# EAGLE schematic alf_board_v8 (EAGLE 6.3)
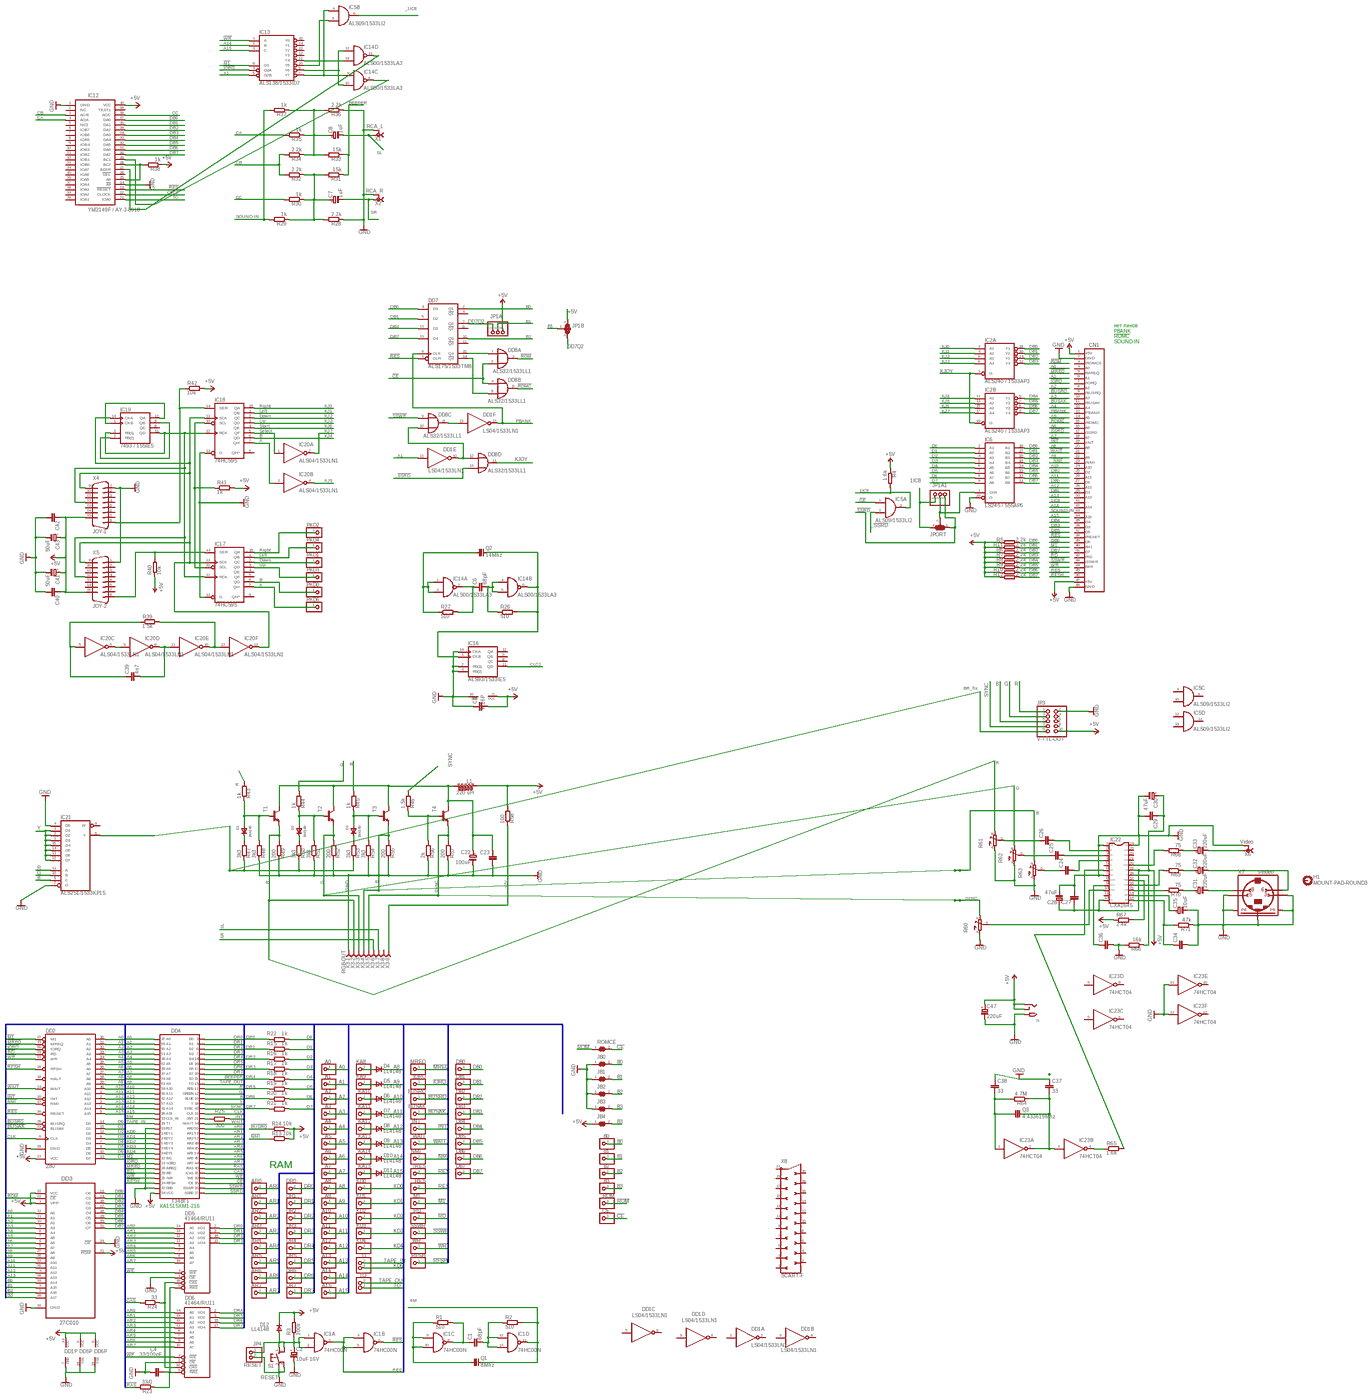
[diagram p0: schematic, sheet 1, overview]
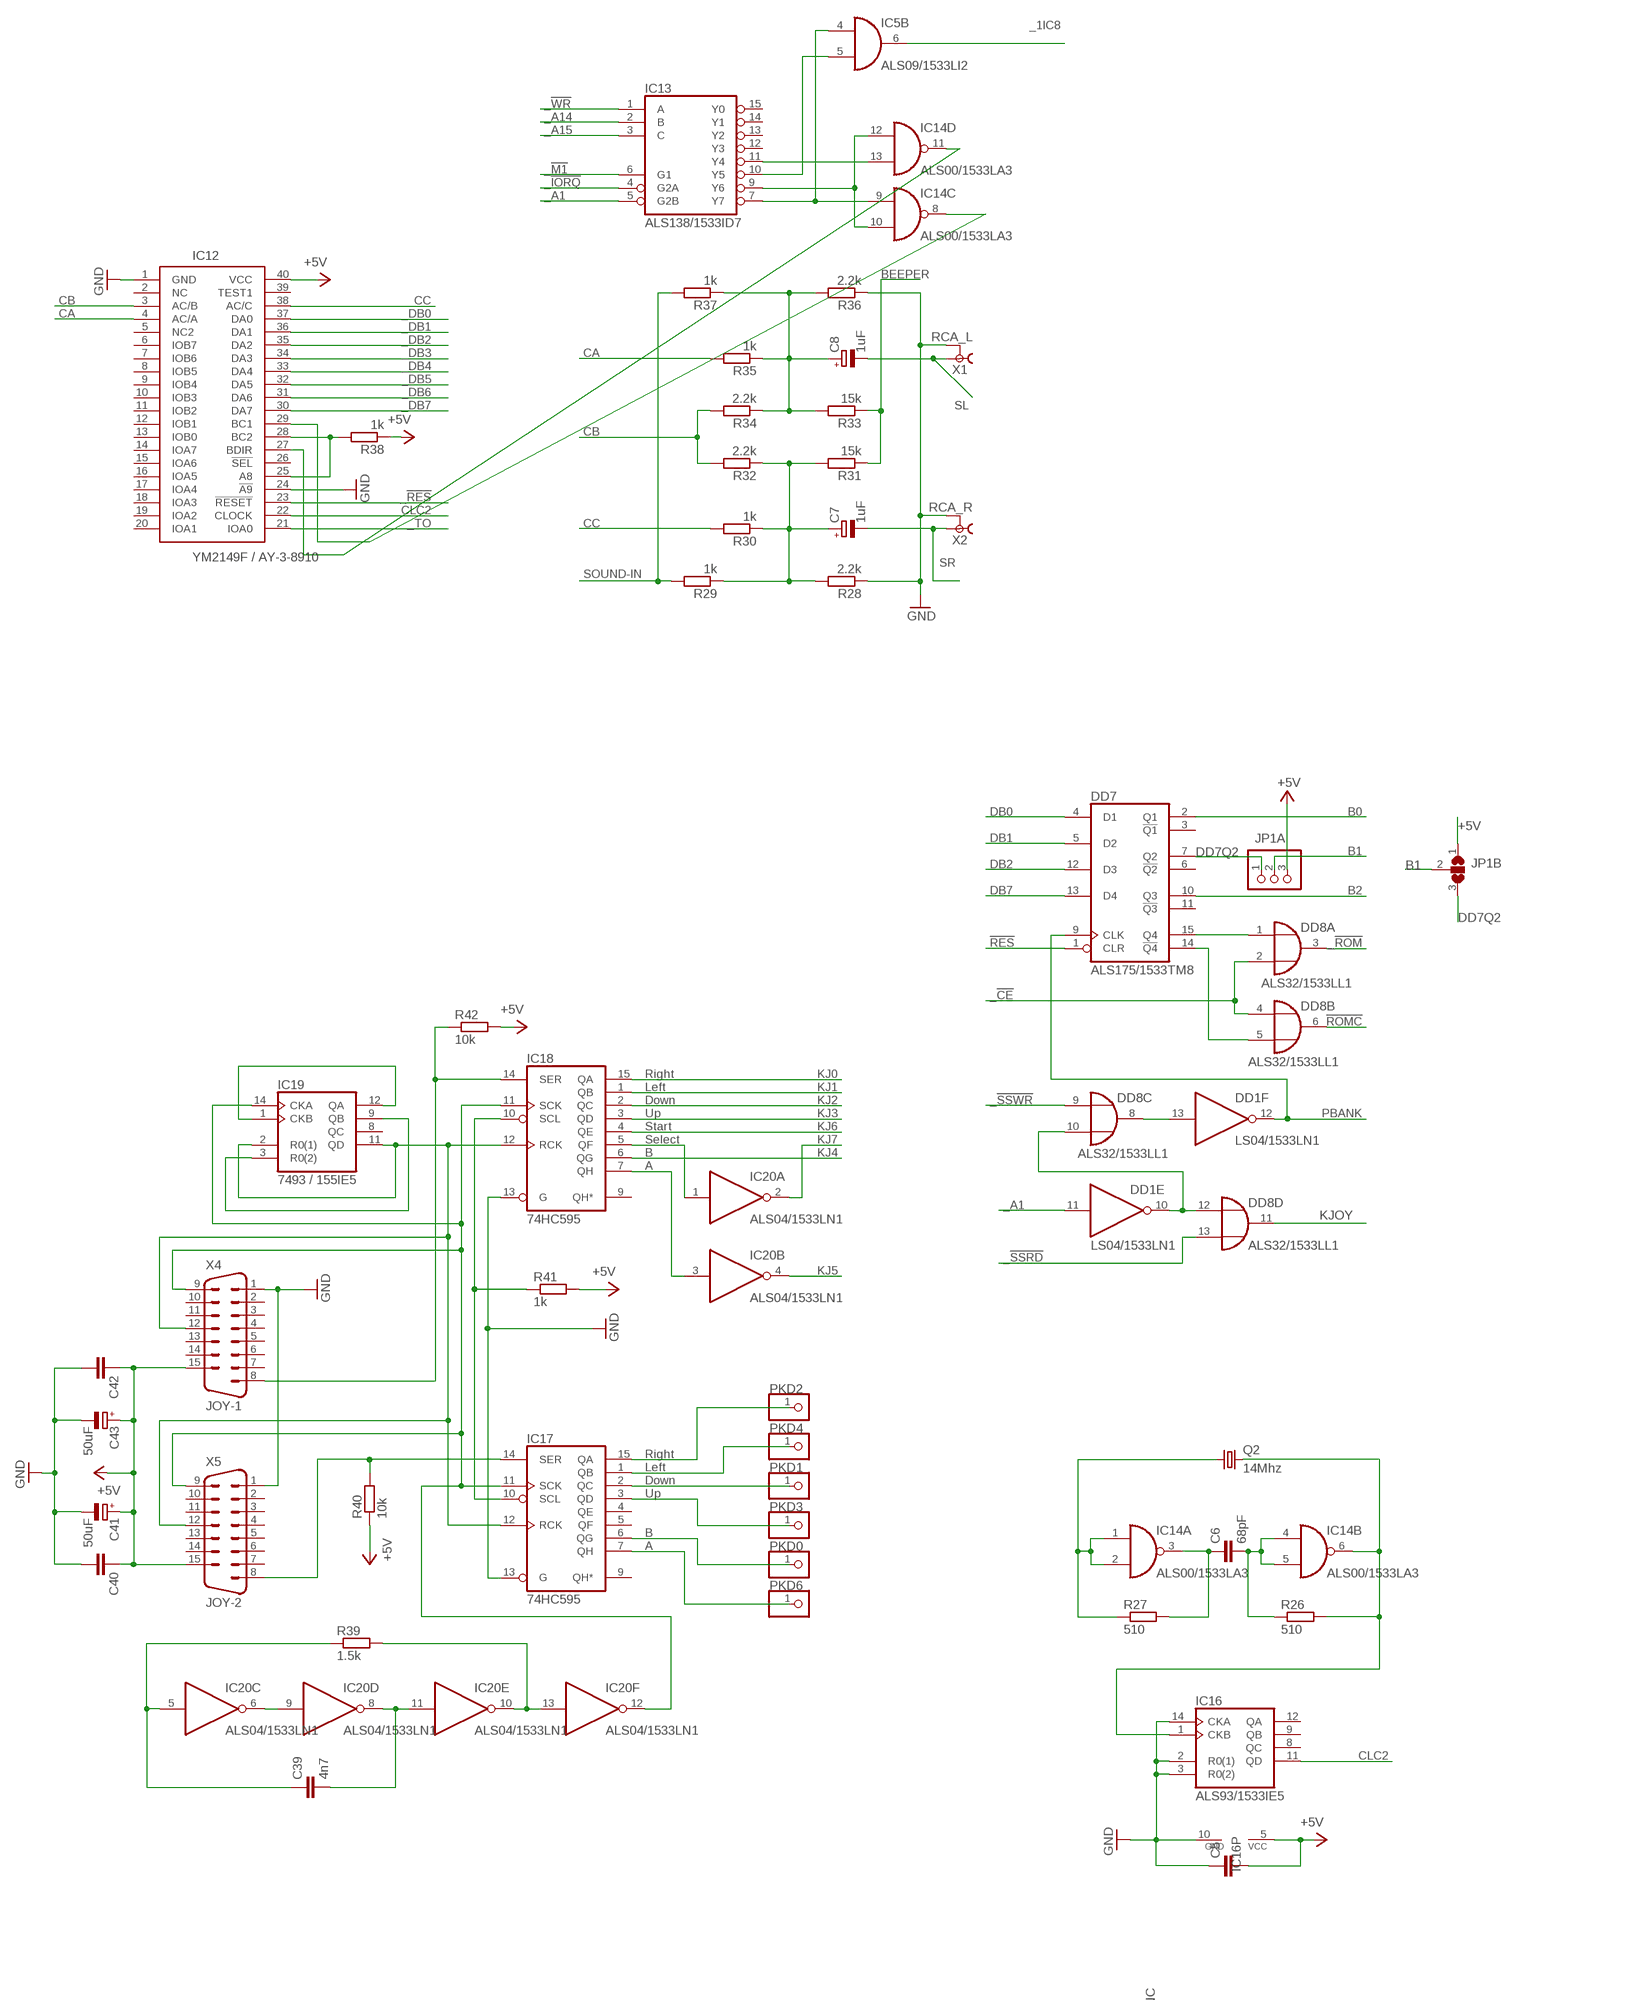
[diagram p1: schematic, sheet 1, part 1 of 4]
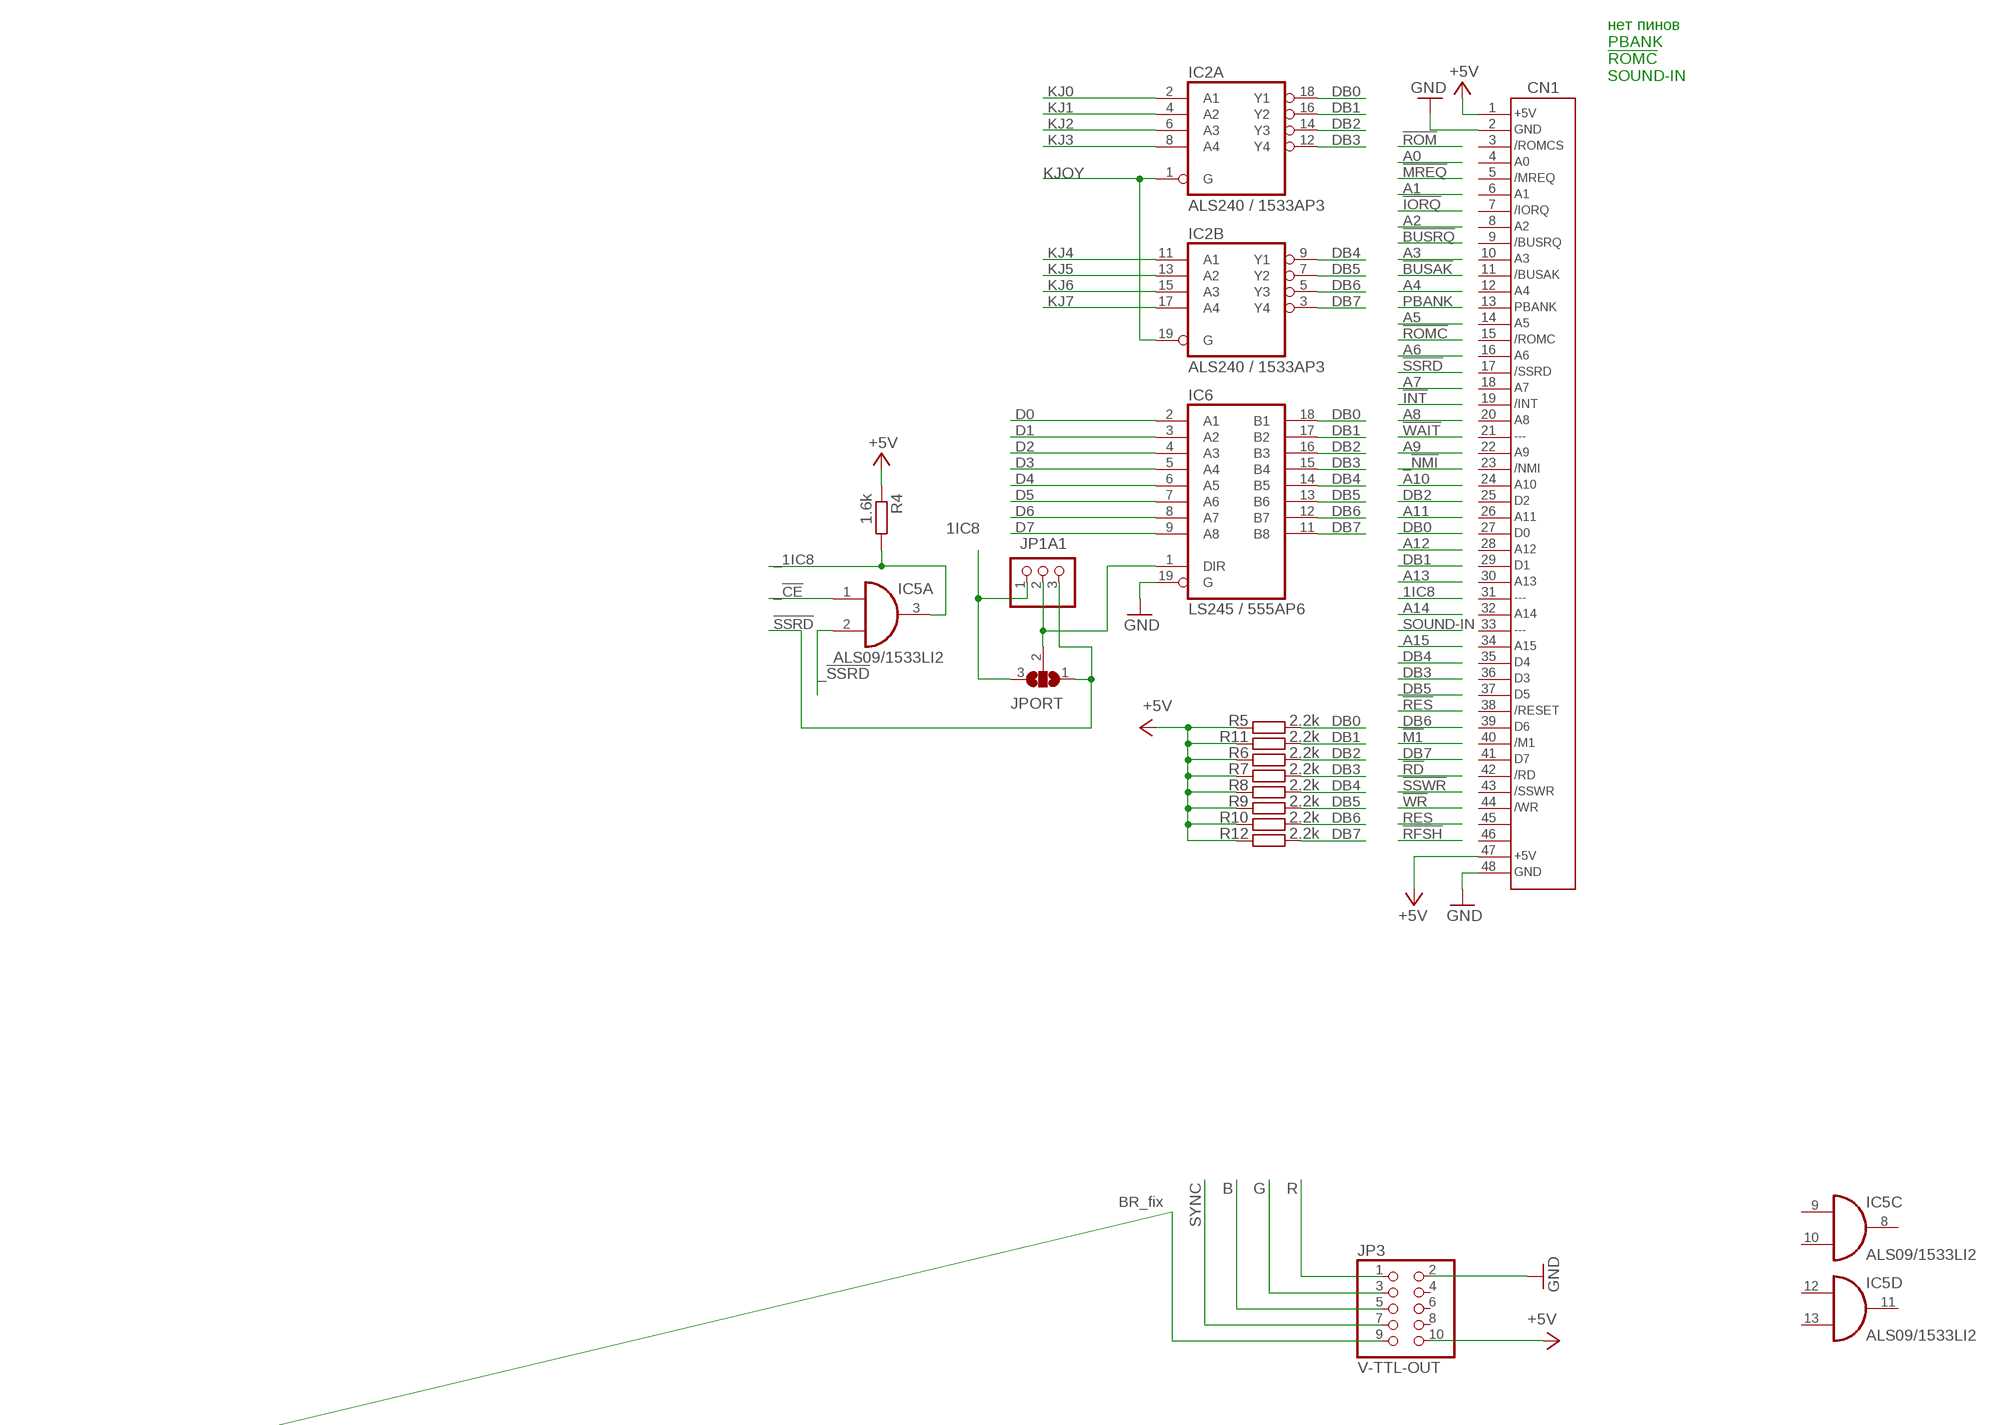
[diagram p2: schematic, sheet 1, part 2 of 4]
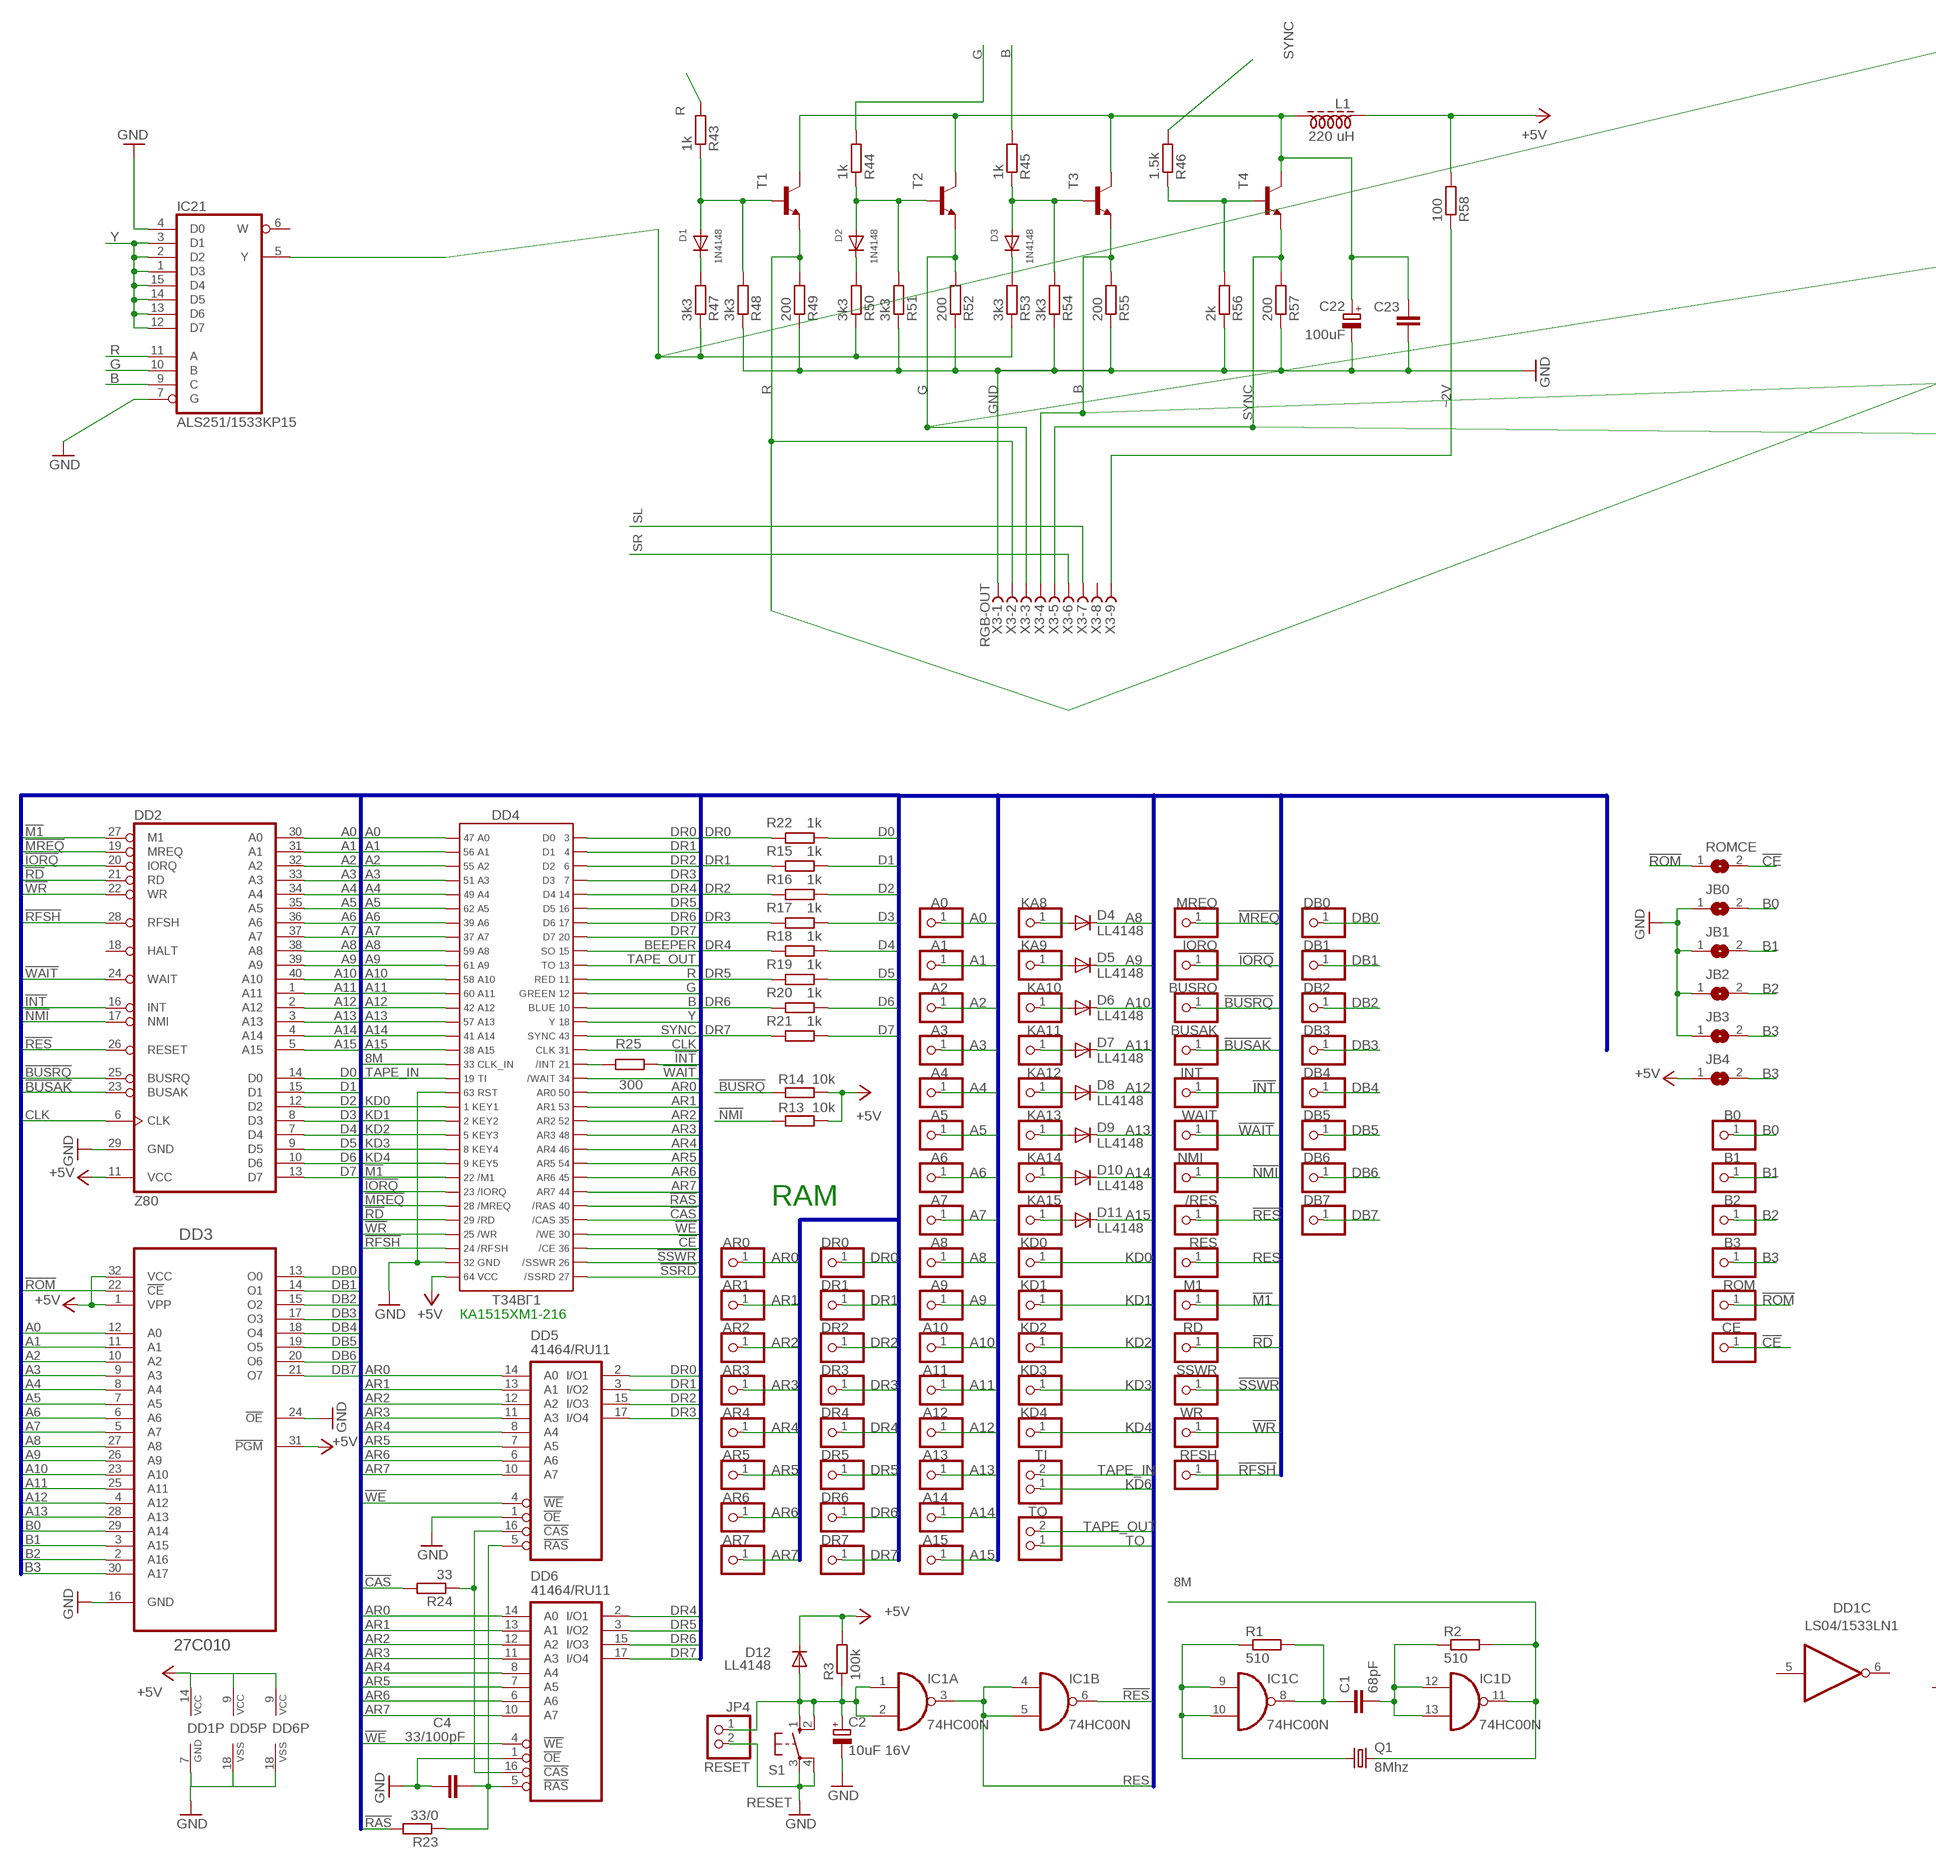
[diagram p3: schematic, sheet 1, part 3 of 4]
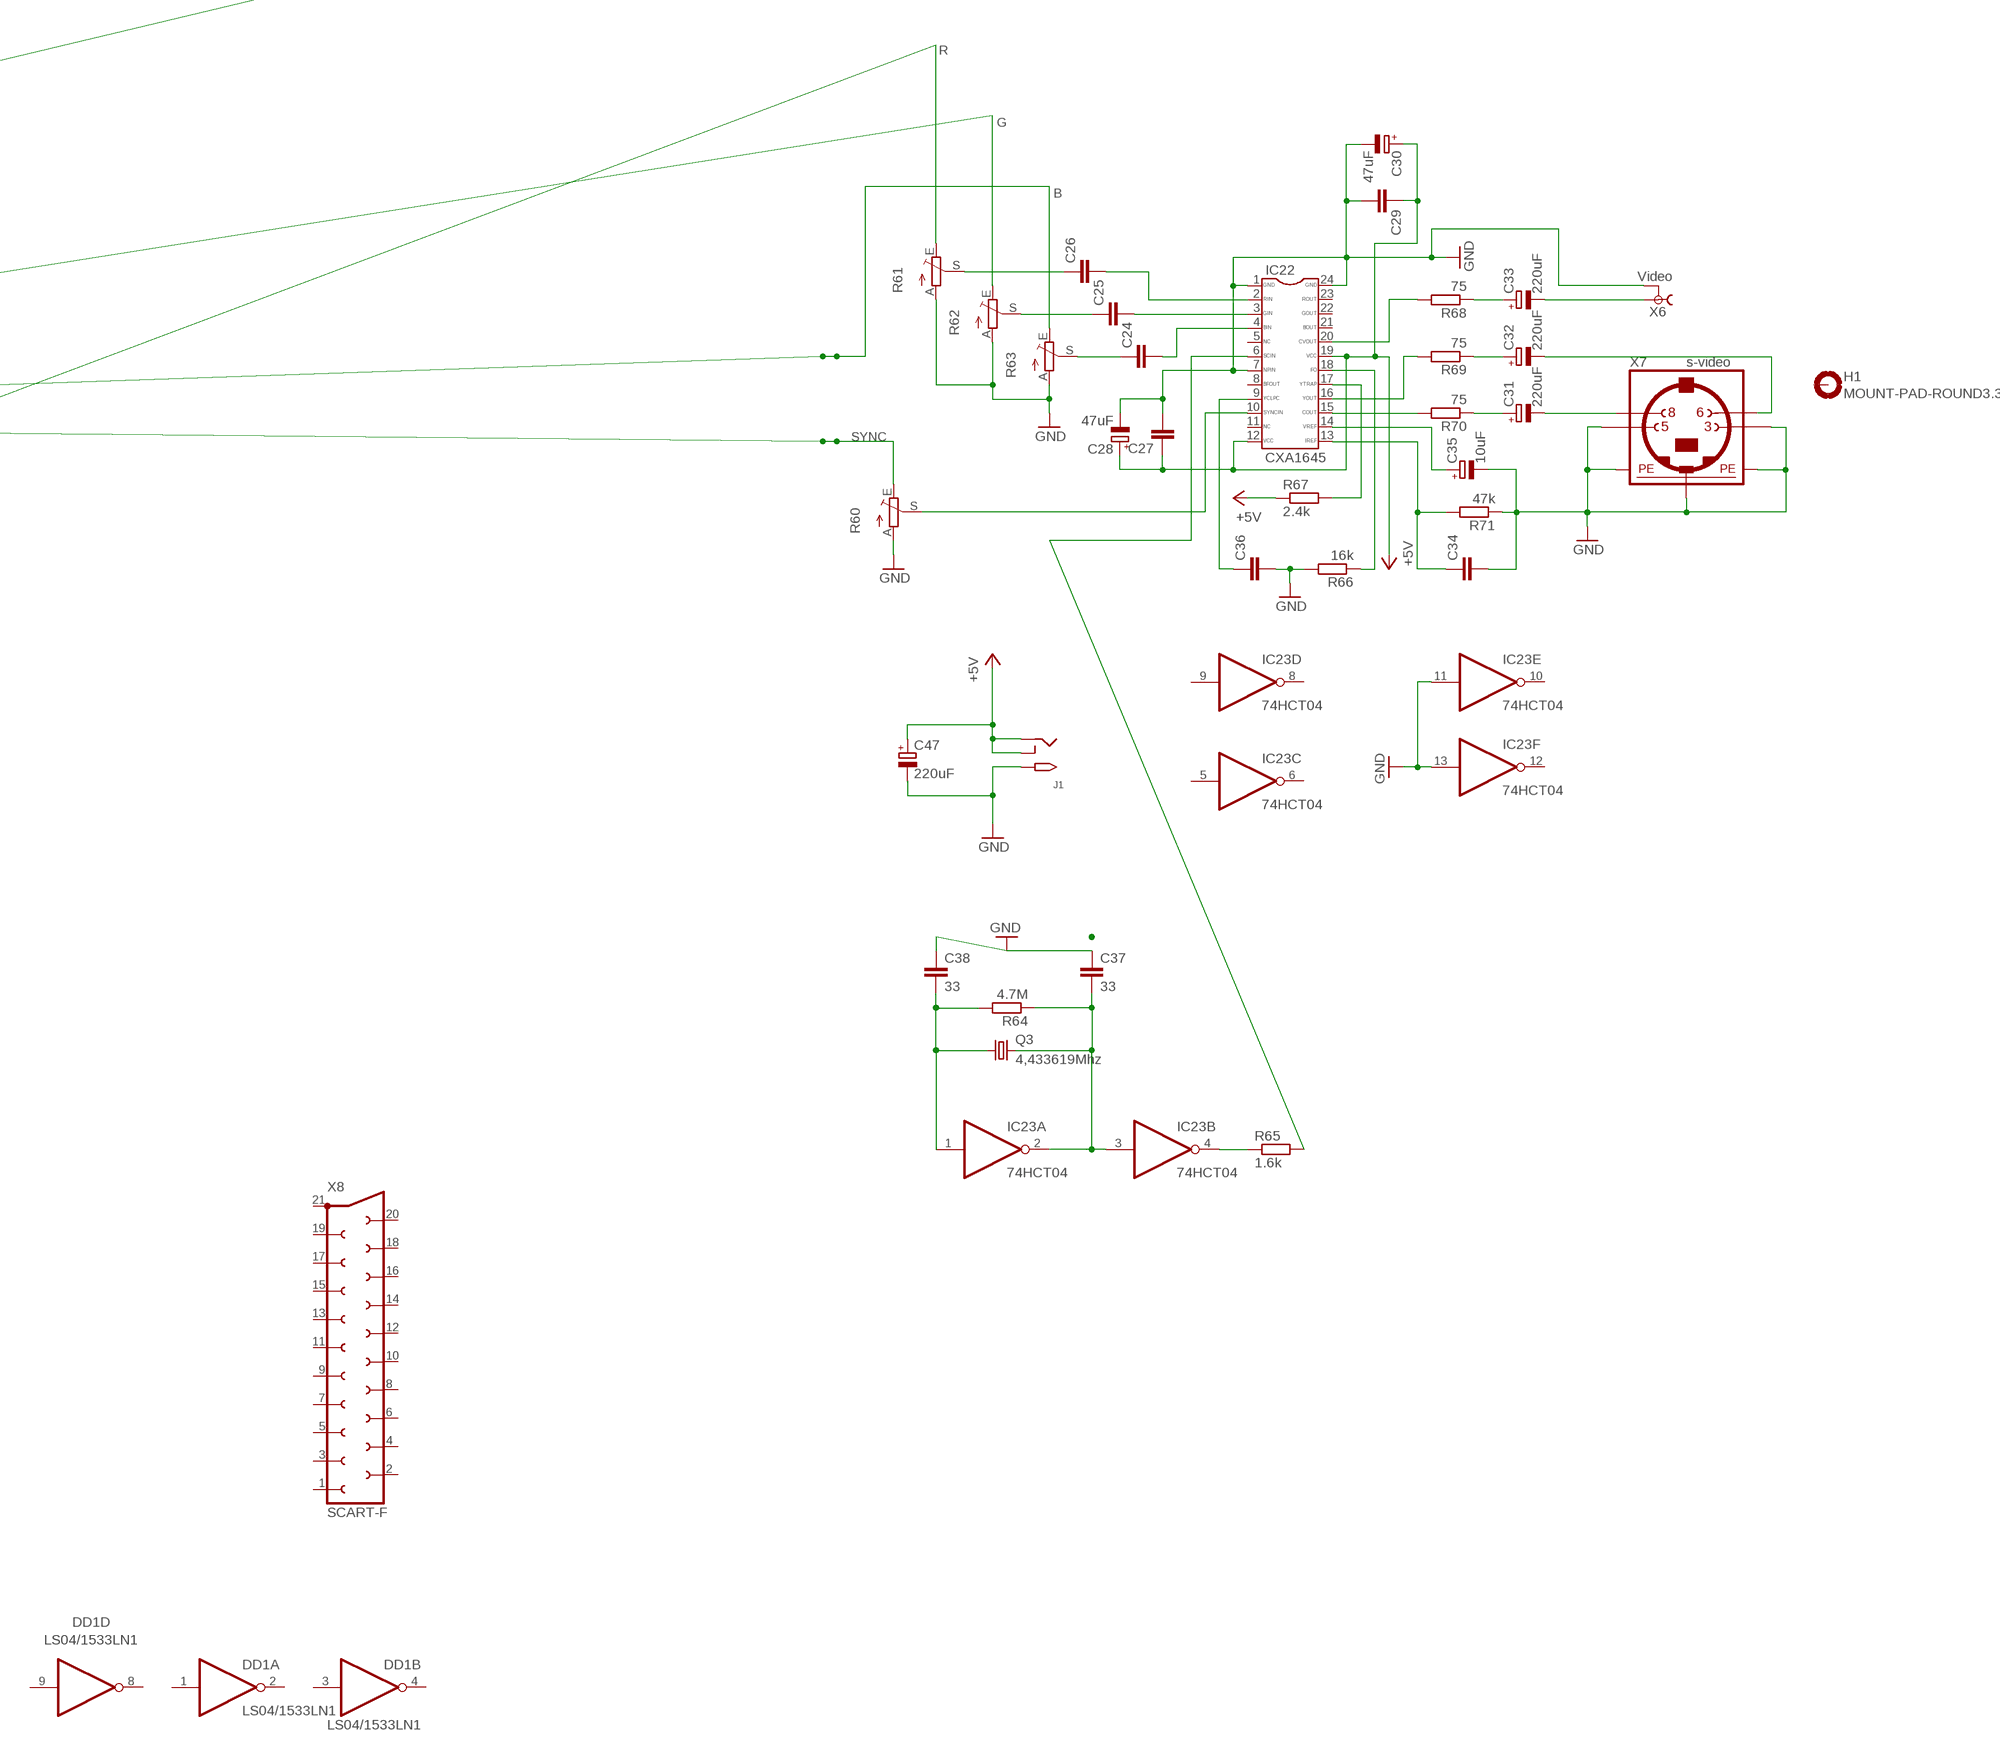
[diagram p4: schematic, sheet 1, part 4 of 4]

## Parts
/RES  PINHD-1X1  [1X01]
A0  PINHD-1X1  [1X01]
A1  PINHD-1X1  [1X01]
A2  PINHD-1X1  [1X01]
A3  PINHD-1X1  [1X01]
A4  PINHD-1X1  [1X01]
A5  PINHD-1X1  [1X01]
A6  PINHD-1X1  [1X01]
A7  PINHD-1X1  [1X01]
A8  PINHD-1X1  [1X01]
A9  PINHD-1X1  [1X01]
A10  PINHD-1X1  [1X01]
A11  PINHD-1X1  [1X01]
A12  PINHD-1X1  [1X01]
A13  PINHD-1X1  [1X01]
A14  PINHD-1X1  [1X01]
A15  PINHD-1X1  [1X01]
AR0  PINHD-1X1  [1X01]
AR1  PINHD-1X1  [1X01]
AR2  PINHD-1X1  [1X01]
AR3  PINHD-1X1  [1X01]
AR4  PINHD-1X1  [1X01]
AR5  PINHD-1X1  [1X01]
AR6  PINHD-1X1  [1X01]
AR7  PINHD-1X1  [1X01]
B0  PINHD-1X1  [1X01]
B1  PINHD-1X1  [1X01]
B2  PINHD-1X1  [1X01]
B3  PINHD-1X1  [1X01]
BUSAK  PINHD-1X1  [1X01]
BUSRQ  PINHD-1X1  [1X01]
C1  68pF  C-EUC0805  [C0805]
C2  10uF 16V  CPOL-EUSMCA  [SMC_A]
C4  33/100pF  C-EU102-043X133  [C102-043X133]
C5  C-EUC0805  [C0805]
C6  68pF  C-EUC0805  [C0805]
C7  1uF  CPOL-EUSMCA  [SMC_A]
C8  1uF  CPOL-EUSMCA  [SMC_A]
C22  100uF  CPOL-EUSMCB  [SMC_B]
C23  C-EUC0805  [C0805]
C24  C-EUC0805  [C0805]
C25  C-EUC0805  [C0805]
C26  C-EUC0805  [C0805]
C27  C-EUC0805  [C0805]
C28  47uF  CPOL-EUSMCB  [SMC_B]
C29  C-EUC0805  [C0805]
C30  47uF  CPOL-EUSMCB  [SMC_B]
C31  220uF  CPOL-EUSMCD  [SMC_D]
C32  220uF  CPOL-EUSMCD  [SMC_D]
C33  220uF  CPOL-EUSMCD  [SMC_D]
C34  C-EUC0805  [C0805]
C35  10uF  CPOL-EUSMCA  [SMC_A]
C36  C-EUC0805  [C0805]
C37  33  C-EUC0805  [C0805]
C38  33  C-EUC0805  [C0805]
C39  4n7  C-EUC0805  [C0805]
C40  C-EUC0805  [C0805]
C41  50uF  CPOL-EUSMCB  [SMC_B]
C42  C-EUC0805  [C0805]
C43  50uF  CPOL-EUSMCB  [SMC_B]
C47  220uF  CPOL-EUSMCD  [SMC_D]
CE  PINHD-1X1  [1X01]
CN1  СНП15-48  [СНП15-48]
D1  1N4148  DIODEDO-1N4148  [DO-1N4148]
D2  1N4148  DIODEDO-1N4148  [DO-1N4148]
D3  1N4148  DIODEDO-1N4148  [DO-1N4148]
D4  LL4148  DIODE-SOD80C  [SOD80C]
D5  LL4148  DIODE-SOD80C  [SOD80C]
D6  LL4148  DIODE-SOD80C  [SOD80C]
D7  LL4148  DIODE-SOD80C  [SOD80C]
D8  LL4148  DIODE-SOD80C  [SOD80C]
D9  LL4148  DIODE-SOD80C  [SOD80C]
D10  LL4148  DIODE-SOD80C  [SOD80C]
D11  LL4148  DIODE-SOD80C  [SOD80C]
D12  LL4148  DIODE-SOD80C  [SOD80C]
DB0  PINHD-1X1  [1X01]
DB1  PINHD-1X1  [1X01]
DB2  PINHD-1X1  [1X01]
DB3  PINHD-1X1  [1X01]
DB4  PINHD-1X1  [1X01]
DB5  PINHD-1X1  [1X01]
DB6  PINHD-1X1  [1X01]
DB7  PINHD-1X1  [1X01]
DD1  LS04/1533LN1  74LS04N  [DIL14]
DD2  Z80  Z80CPU  [DIL40]
DD3  27C010  AT27C020-90PU  [DIP254P1524X482-32P]
DD4  Т34ВГ1  Т34ВГ1MF  [TQFP64-MF]
DD5  41464/RU11  41464  [DIL18]
DD6  41464/RU11  41464  [DIL18]
DD7  ALS175/1533TM8  74LS175N  [DIL16]
DD8  ALS32/1533LL1  74LS32N  [DIL14]
DR0  PINHD-1X1  [1X01]
DR1  PINHD-1X1  [1X01]
DR2  PINHD-1X1  [1X01]
DR3  PINHD-1X1  [1X01]
DR4  PINHD-1X1  [1X01]
DR5  PINHD-1X1  [1X01]
DR6  PINHD-1X1  [1X01]
DR7  PINHD-1X1  [1X01]
H1  MOUNT-PAD-ROUND3.3  [3,3-PAD]
IC1  74HC00N  [DIL14]
IC2  ALS240 / 1533AP3  74LS240N  [DIL20]
IC5  ALS09/1533LI2  74LS09N  [DIL14]
IC6  LS245 / 555AP6  74LS245DW  [SO20W]
IC12  YM2149F / AY-3-8910  YM2149F  [DIL40]
IC13  ALS138/1533ID7  74LS138N  [DIL16]
IC14  ALS00/1533LA3  74LS00N  [DIL14]
IC16  ALS93/1533IE5  74LS93N  [DIL14]
IC17  74HC595  74HC595N  [DIL16]
IC18  74HC595  74HC595N  [DIL16]
IC19  7493 / 155IE5  74LS93N  [DIL14]
IC20  ALS04/1533LN1  74LS04N  [DIL14]
IC21  ALS251/1533KP15  74LS251N  [DIL16]
IC22  CXA1645  [SOP24]
IC23  74HCT04  74HCT04N  [DIL14]
INT  PINHD-1X1  [1X01]
IORQ  PINHD-1X1  [1X01]
J1  2.1MMJACKTHM  [PJ-102A]
JB0  SJ  [SJ]
JB1  SJ  [SJ]
JB2  SJ  [SJ]
JB3  SJ  [SJ]
JB4  SJ  [SJ]
JP1A  PINHD-1X3  [1X03]
JP1A1  PINHD-1X3  [1X03]
JP1B  SJ2W  [SJ_2]
JP3  V-TTL-OUT  PINHD-2X5  [2X05]
JP4  RESET  PINHD-1X2  [1X02]
JPORT  SJ2W  [SJ_2]
KA8  PINHD-1X1  [1X01]
KA9  PINHD-1X1  [1X01]
KA10  PINHD-1X1  [1X01]
KA11  PINHD-1X1  [1X01]
KA12  PINHD-1X1  [1X01]
KA13  PINHD-1X1  [1X01]
KA14  PINHD-1X1  [1X01]
KA15  PINHD-1X1  [1X01]
KD0  PINHD-1X1  [1X01]
KD1  PINHD-1X1  [1X01]
KD2  PINHD-1X1  [1X01]
KD3  PINHD-1X1  [1X01]
KD4  PINHD-1X1  [1X01]
L1  220 uH  Z27/24CW  [Z27/24]
M1  PINHD-1X1  [1X01]
MREQ  PINHD-1X1  [1X01]
NMI  PINHD-1X1  [1X01]
PKD0  PINHD-1X1  [1X01]
PKD1  PINHD-1X1  [1X01]
PKD2  PINHD-1X1  [1X01]
PKD3  PINHD-1X1  [1X01]
PKD4  PINHD-1X1  [1X01]
PKD6  PINHD-1X1  [1X01]
Q1  8Mhz  CRYSTALHC49S  [HC49/S]
Q2  14Mhz  CRYSTALHC49S  [HC49/S]
Q3  4,433619Mhz  CRYSTALHC49S  [HC49/S]
R1  510  R-EU_R0805  [R0805]
R2  510  R-EU_R0805  [R0805]
R3  100k  R-EU_R0805  [R0805]
R4  1.6k  R-EU_R0805  [R0805]
R5  2.2k  R-EU_R0805  [R0805]
R6  2.2k  R-EU_R0805  [R0805]
R7  2.2k  R-EU_R0805  [R0805]
R8  2.2k  R-EU_R0805  [R0805]
R9  2.2k  R-EU_R0805  [R0805]
R10  2.2k  R-EU_R0805  [R0805]
R11  2.2k  R-EU_R0805  [R0805]
R12  2.2k  R-EU_R0805  [R0805]
R13  10k  R-EU_R0805  [R0805]
R14  10k  R-EU_R0805  [R0805]
R15  1k  R-EU_R0805  [R0805]
R16  1k  R-EU_R0805  [R0805]
R17  1k  R-EU_R0805  [R0805]
R18  1k  R-EU_R0805  [R0805]
R19  1k  R-EU_R0805  [R0805]
R20  1k  R-EU_R0805  [R0805]
R21  1k  R-EU_R0805  [R0805]
R22  1k  R-EU_R0805  [R0805]
R23  33/0  R-EU_0207/12  [0207/12]
R24  33  R-EU_0207/10  [0207/10]
R25  300  R-EU_R0805  [R0805]
R26  510  R-EU_R0805  [R0805]
R27  510  R-EU_R0805  [R0805]
R28  2.2k  R-EU_R0805  [R0805]
R29  1k  R-EU_R0805  [R0805]
R30  1k  R-EU_R0805  [R0805]
R31  15k  R-EU_R0805  [R0805]
R32  2.2k  R-EU_R0805  [R0805]
R33  15k  R-EU_R0805  [R0805]
R34  2.2k  R-EU_R0805  [R0805]
R35  1k  R-EU_R0805  [R0805]
R36  2.2k  R-EU_R0805  [R0805]
R37  1k  R-EU_R0805  [R0805]
R38  1k  R-EU_R0805  [R0805]
R39  1.5k  R-EU_R0805  [R0805]
R40  10k  R-EU_R0805  [R0805]
R41  1k  R-EU_R0805  [R0805]
R42  10k  R-EU_R0805  [R0805]
R43  1k  R-EU_R0805  [R0805]
R44  1k  R-EU_R0805  [R0805]
R45  1k  R-EU_R0805  [R0805]
R46  1.5k  R-EU_R0805  [R0805]
R47  3k3  R-EU_R0805  [R0805]
R48  3k3  R-EU_R0805  [R0805]
R49  200  R-EU_R0805  [R0805]
R50  3k3  R-EU_R0805  [R0805]
R51  3k3  R-EU_R0805  [R0805]
R52  200  R-EU_R0805  [R0805]
R53  3k3  R-EU_R0805  [R0805]
R54  3k3  R-EU_R0805  [R0805]
R55  200  R-EU_R0805  [R0805]
R56  2k  R-EU_R0805  [R0805]
R57  200  R-EU_R0805  [R0805]
R58  100  R-EU_R0805  [R0805]
R60  TRIM_EU-CA6V  [CA6V]
R61  TRIM_EU-CA6V  [CA6V]
R62  TRIM_EU-CA6V  [CA6V]
R63  TRIM_EU-CA6V  [CA6V]
R64  4.7M  R-EU_R0805  [R0805]
R65  1.6k  R-EU_R0805  [R0805]
R66  16k  R-EU_R0805  [R0805]
R67  2.4k  R-EU_R0805  [R0805]
R68  75  R-EU_R0805  [R0805]
R69  75  R-EU_R0805  [R0805]
R70  75  R-EU_R0805  [R0805]
R71  47k  R-EU_R0805  [R0805]
RD  PINHD-1X1  [1X01]
RES  PINHD-1X1  [1X01]
RFSH  PINHD-1X1  [1X01]
ROM  PINHD-1X1  [1X01]
ROMCE  SJ  [SJ]
S1  RESET  10-XX  [B3F-10XX]
SSWR  PINHD-1X1  [1X01]
T1  BC549-NPN-TO92-CBE  [TO92-CBE]
T2  BC549-NPN-TO92-CBE  [TO92-CBE]
T3  BC549-NPN-TO92-CBE  [TO92-CBE]
T4  BC549-NPN-TO92-CBE  [TO92-CBE]
TI  PINHD-1X2  [1X02]
TO  PINHD-1X2  [1X02]
WAIT  PINHD-1X1  [1X01]
WR  PINHD-1X1  [1X01]
X1  RCA_L  TOBU3  [TOBU3]
X2  RCA_R  TOBU3  [TOBU3]
X3  RGB-OUT  D-SUB9-H5M09RA  [H5M09RA]
X4  JOY-1  M15HP  [M15HP]
X5  JOY-2  M15HP  [M15HP]
X6  Video  TOBU3  [TOBU3]
X7  s-video  MINI_DIN_4  [M_DIN4]
X8  SCART-F  [SCART-F]

## Nets
1IC8: JP1A1.1 JPORT.3
8M: DD4.33 IC1.11(D:O) Q1.2 R2.2
!BUSAK: BUSAK.1 DD2.23(BUSAK)
!BUSRQ: BUSRQ.1 DD2.25(BUSRQ) R14.2
!CAS: DD4.35 R24.2
!CE: CE.1 DD4.36 ROMCE.2
!INT: DD2.16(INT) INT.1 R25.2
!IORQ: DD2.20(IORQ) DD4.23 IORQ.1
!M1: DD2.27(M1) DD4.22 M1.1
!MREQ: DD2.19(MREQ) DD4.28 MREQ.1
!NMI: DD2.17(NMI) NMI.1 R13.2
!RAS: DD4.40 R23.2
!RD: DD2.21(RD) DD4.29 RD.1
!RES: /RES.1 DD2.26(RESET) DD7.1(CLR) IC1.6(B:O)
!RFSH: DD2.28(RFSH) DD4.24 RFSH.1
!ROM: DD3.22(!CE) ROM.1 ROMCE.1
!ROMC: DD8.6(B:O)
!SSRD: DD4.27 JP1A1.3 JPORT.1
!SSWR: DD4.26 SSWR.1
!WAIT: DD2.24(WAIT) DD4.34 WAIT.1
!WE: DD4.30 DD5.4(!WE) DD6.4(!WE)
!WR: DD2.22(WR) DD4.25 WR.1
+5V: C5.2 C27.1 C28.+ C29.1 C30.+ C40.1 C41.+ C42.1 C43.+ C47.+ CN1.1 CN1.47 D12.C DD1.14(P:VCC) DD2.11(VCC) DD3.1(VPP) DD3.31(!PGM) DD3.32(VCC) DD4.64 DD5.9(VCC) DD6.9(VCC) IC12.40(VCC) IC16.5(VCC) IC22.12 IC22.19 J1.RING J1.RING_SW JB4.1 JP1A.3 JP1B.1 JP3.10 L1.1 R3.2 R4.1 R5.1 R6.1 R7.1 R8.1 R9.1 R10.1 R11.1 R12.1 R13.1 R14.1 R38.1 R40.1 R41.2 R42.2 R58.2 R67.1 X4.15 X5.15
_1IC8: IC5.3(A:O) IC5.6(B:O) R4.2
_!CE: DD8.2(A:I1) DD8.4(B:I0) IC5.1(A:I0)
_!IORQ: IC13.4(G2A)
_!M1: IC13.6(G1)
_!RES: IC12.23(!RESET)
_!ROM: DD8.3(A:O)
_!SSRD: DD8.13(D:I1) IC5.2(A:I1)
_!SSWR: DD8.9(C:I0)
_!WR: IC13.1(A)
_A1: DD1.11(E:I) IC13.5(G2B)
_A14: IC13.2(B)
_A15: IC13.3(C)
_DB0: IC12.37(DA0)
_DB1: IC12.36(DA1)
_DB2: IC12.35(DA2)
_DB3: IC12.34(DA3)
_DB4: IC12.33(DA4)
_DB5: IC12.32(DA5)
_DB6: IC12.31(DA6)
_DB7: IC12.30(DA7)
_TO: IC12.21(IOA0)
A0: A0.1 DD2.30(A0) DD3.12(A0) DD4.47
A1: A1.1 DD2.31(A1) DD3.11(A1) DD4.56
A2: A2.1 DD2.32(A2) DD3.10(A2) DD4.55
A3: A3.1 DD2.33(A3) DD3.9(A3) DD4.51
A4: A4.1 DD2.34(A4) DD3.8(A4) DD4.49
A5: A5.1 DD2.35(A5) DD3.7(A5) DD4.62
A6: A6.1 DD2.36(A6) DD3.6(A6) DD4.39
A7: A7.1 DD2.37(A7) DD3.5(A7) DD4.37
A8: A8.1 D4.C DD2.38(A8) DD3.27(A8) DD4.59
A9: A9.1 D5.C DD2.39(A9) DD3.26(A9) DD4.61
A10: A10.1 D6.C DD2.40(A10) DD3.23(A10) DD4.58
A11: A11.1 D7.C DD2.1(A11) DD3.25(A11) DD4.60
A12: A12.1 D8.C DD2.2(A12) DD3.4(A12) DD4.42
A13: A13.1 D9.C DD2.3(A13) DD3.28(A13) DD4.57
A14: A14.1 D10.C DD2.4(A14) DD4.41
A15: A15.1 D11.C DD2.5(A15) DD4.38
AR0: AR0.1 DD4.50 DD5.14(A0) DD6.14(A0)
AR1: AR1.1 DD4.53 DD5.13(A1) DD6.13(A1)
AR2: AR2.1 DD4.52 DD5.12(A2) DD6.12(A2)
AR3: AR3.1 DD4.48 DD5.11(A3) DD6.11(A3)
AR4: AR4.1 DD4.46 DD5.8(A4) DD6.8(A4)
AR5: AR5.1 DD4.54 DD5.7(A5) DD6.7(A5)
AR6: AR6.1 DD4.45 DD5.6(A6) DD6.6(A6)
AR7: AR7.1 DD4.44 DD5.10(A7) DD6.10(A7)
B: DD4.10 IC21.9(C) JP3.5 R45.2
B0: B0.1 DD3.29(A14) DD7.2(Q1) JB0.2
B1: B1.1 DD3.3(A15) JB1.2 JP1A.2 JP1B.2
B2: B2.1 DD3.2(A16) DD7.10(Q3) JB2.2
B3: B3.1 DD3.30(A17) JB3.2 JB4.2
BEEPER: DD4.15 R31.1 R33.1
CA: IC12.4(AC/A) R35.2
CAS_RAM: DD5.16(!CAS) DD6.16(!CAS) R24.1
CB: IC12.3(AC/B) R32.2 R34.2
CC: IC12.38(AC/C) R30.2
CLC2: IC12.22(CLOCK) IC16.11(QD)
CLK: DD2.6(CLK) DD4.31
D0: DD2.14(D0) IC6.2(A1) R22.1
D1: DD2.15(D1) IC6.3(A2) R15.1
D2: DD2.12(D2) IC6.4(A3) R16.1
D3: DD2.8(D3) IC6.5(A4) R17.1
D4: DD2.7(D4) IC6.6(A5) R18.1
D5: DD2.9(D5) IC6.7(A6) R19.1
D6: DD2.10(D6) IC6.8(A7) R20.1
D7: DD2.13(D7) IC6.9(A8) R21.1
DB0: DB0.1 DD3.13(O0) DD7.4(D1) IC2.18(A:Y1) IC6.18(B1) R5.2
DB1: DB1.1 DD3.14(O1) DD7.5(D2) IC2.16(A:Y2) IC6.17(B2) R11.2
DB2: DB2.1 DD3.15(O2) DD7.12(D3) IC2.14(A:Y3) IC6.16(B3) R6.2
DB3: DB3.1 DD3.17(O3) IC2.12(A:Y4) IC6.15(B4) R7.2
DB4: DB4.1 DD3.18(O4) IC2.9(B:Y1) IC6.14(B5) R8.2
DB5: DB5.1 DD3.19(O5) IC2.7(B:Y2) IC6.13(B6) R9.2
DB6: DB6.1 DD3.20(O6) IC2.5(B:Y3) IC6.12(B7) R10.2
DB7: DB7.1 DD3.21(O7) DD7.13(D4) IC2.3(B:Y4) IC6.11(B8) R12.2
DD7Q2: DD7.7(Q2) JP1A.1 JP1B.3
DR0: DD4.3 DD5.2(I/O1) DR0.1 R22.2
DR1: DD4.4 DD5.3(I/O2) DR1.1 R15.2
DR2: DD4.6 DD5.15(I/O3) DR2.1 R16.2
DR3: DD4.7 DD5.17(I/O4) DR3.1 R17.2
DR4: DD4.14 DD6.2(I/O1) DR4.1 R18.2
DR5: DD4.16 DD6.3(I/O2) DR5.1 R19.2
DR6: DD4.17 DD6.15(I/O3) DR6.1 R20.2
DR7: DD4.20 DD6.17(I/O4) DR7.1 R21.2
G: DD4.12 IC21.10(B) JP3.3 R44.2
GND: C2.- C4.1 C5.1 C22.- C23.2 C27.2 C28.- C29.2 C30.- C34.2 C35.- C36.2 C37.1 C38.1 C40.2 C41.- C42.2 C43.- C47.- CN1.2 CN1.48 DD1.7(P:GND) DD2.29(GND) DD3.16(GND) DD3.24(!OE) DD4.32 DD4.63 DD5.1(!OE) DD5.18(VSS) DD6.1(!OE) DD6.18(VSS) IC6.19(G) IC12.1(GND) IC12.24(!A9) IC16.2(R0(1)) IC16.3(R0(2)) IC16.10(GND) IC16.14(CKA) IC17.13(G) IC18.13(G) IC21.4(D0) IC21.7(G) IC22.1 IC22.7 IC22.24 IC23.11(E:I) IC23.13(F:I) J1.TIP JB0.1 JB1.1 JB2.1 JB3.1 JP3.2 JP4.2 R28.1 R36.1 R48.1 R49.1 R51.1 R52.1 R54.1 R55.1 R56.1 R57.1 R60.A R61.A R62.A R63.A R66.2 R71.1 S1.3(P) S1.4(P1) X1.2 X1.2@1 X1.2@2 X2.2 X2.2@1 X2.2@2 X3.1 X4.1 X5.1 X6.2 X6.2@1 X6.2@2 X7.3 X7.5 X7.SH1(PE1) X7.SH2(PE2) X7.SH3(PE3)
KD0: DD4.1 KD0.1
KD1: DD4.2 KD1.1
KD2: DD4.5 KD2.1
KD3: DD4.8 KD3.1
KD4: DD4.9 KD4.1
KD6: TI.1
KJ0: IC2.2(A:A1) IC18.15(QA)
KJ1: IC2.4(A:A2) IC18.1(QB)
KJ2: IC2.6(A:A3) IC18.2(QC)
KJ3: IC2.8(A:A4) IC18.3(QD)
KJ4: IC2.11(B:A1) IC18.6(QG)
KJ5: IC2.13(B:A2) IC20.4(B:O)
KJ6: IC2.15(B:A3) IC18.4(QE)
KJ7: IC2.17(B:A4) IC20.2(A:O)
KJOY: DD8.11(D:O) IC2.1(A:G) IC2.19(B:G)
N$1: IC23.4(B:O) R65.1
N$2: C1.1 IC1.8(C:O) R1.2
N$3: C1.2 IC1.12(D:I0) IC1.13(D:I1) R2.1
N$4: IC1.9(C:I0) IC1.10(C:I1) Q1.1 R1.1
N$5: IC18.5(QF) IC20.1(A:I)
N$6: IC18.7(QH) IC20.3(B:I)
N$7: DD1.13(F:I) DD8.8(C:O)
N$8: C2.+ D12.A IC1.1(A:I0) IC1.2(A:I1) JP4.1 R3.1 S1.1(S) S1.2(S1)
N$9: D4.A KA8.1
N$10: DD1.10(E:O) DD8.10(C:I1) DD8.12(D:I0)
N$11: DD7.14(!Q4) DD8.5(B:I1)
N$13: DD7.15(Q4) DD8.1(A:I0)
N$14: IC17.12(RCK) IC18.12(RCK) IC19.2(R0(1)) IC19.11(QD) X4.12 X5.12
N$15: IC17.7(QH) PKD6.1
N$16: IC12.25(A8) IC12.28(BC2) R38.2
N$17: D1.A R43.1 R48.2 T1.B
N$18: D1.C R47.2
N$19: R49.2 R61.E T1.E X3.2
N$21: D2.A R44.1 R51.2 T2.B
N$22: D2.C R50.2
N$23: R52.2 R62.E T2.E X3.3
N$24: IC22.17 R67.2
N$25: IC12.27(BDIR) IC14.11(D:O)
N$26: IC5.4(B:I0) IC13.7(Y7) IC14.9(C:I0)
N$27: IC13.11(Y4) IC14.13(D:I1)
N$28: IC5.5(B:I1) IC13.10(Y5)
N$29: IC13.9(Y6) IC14.10(C:I1) IC14.12(D:I0)
N$30: IC17.10(SCL) IC18.10(SCL) R41.1
N$31: IC12.29(BC1) IC14.8(C:O)
N$32: C8.+ R33.2 R34.1 R35.1 R36.2 R37.1
N$33: C7.+ R28.2 R29.1 R30.1 R31.2 R32.1
N$34: D3.A R45.1 R54.2 T3.B
N$35: IC17.11(SCK) IC18.11(SCK) IC19.14(CKA) IC20.12(F:O) X4.9 X5.9
N$36: C39.1 IC20.5(C:I) R39.1
N$37: IC14.6(B:O) IC16.1(CKB) Q2.2 R26.2
N$38: IC14.1(A:I0) IC14.2(A:I1) Q2.1 R27.1
N$39: C6.1 IC14.3(A:O) R27.2
N$40: C6.2 IC14.4(B:I0) IC14.5(B:I1) R26.1
N$41: D3.C R53.2
N$42: R55.2 R63.E T3.E X3.4
N$43: R57.2 R60.E T4.E X3.5
N$44: C22.+ C23.1 L1.2 T1.C T2.C T3.C T4.C
N$45: R58.1 X3.9
N$46: IC17.14(SER) R40.2 X5.8
N$47: IC19.3(R0(2)) IC19.9(QB)
N$48: IC18.14(SER) R42.1 X4.8
N$49: IC19.1(CKB) IC19.12(QA)
N$50: C39.2 IC20.8(D:O) IC20.11(E:I)
N$51: IC20.10(E:O) IC20.13(F:I) R39.2
N$52: C26.1 R61.S
N$53: IC20.6(C:O) IC20.9(D:I)
N$54: C25.1 R62.S
N$55: C24.1 R63.S
N$56: C25.2 IC22.3
N$57: C26.2 IC22.2
N$58: C24.2 IC22.4
N$59: C38.2 IC23.1(A:I) Q3.1 R64.2
N$60: C37.2 IC23.2(A:O) IC23.3(B:I) Q3.2 R64.1
N$61: IC22.10 R60.S
N$62: IC21.5(Y) JP3.9 R47.1 R50.1 R53.1
N$63: IC22.6 R65.2
N$64: IC22.20 R68.2
N$65: C36.1 IC22.9
N$66: IC22.18 R66.1
N$67: IC22.16 R69.2
N$68: IC22.15 R70.2
N$69: C33.+ R68.1
N$70: C32.+ R69.1
N$71: C31.+ R70.1
N$72: C35.+ IC22.14
N$73: C34.1 IC22.13 R71.2
N$75: C33.- X6.1
N$78: C32.- X7.6
N$79: C31.- X7.8
N$92: IC17.6(QG) PKD0.1
N$93: D5.A KA9.1
N$94: D6.A KA10.1
N$95: D7.A KA11.1
N$96: D8.A KA12.1
N$97: D9.A KA13.1
N$98: D10.A KA14.1
N$99: D11.A KA15.1
N$100: IC6.1(DIR) JP1A1.2 JPORT.2
N$126: R46.1 R56.2 T4.B
N$127: IC17.3(QD) PKD3.1
N$128: IC17.2(QC) PKD1.1
N$129: IC17.15(QA) PKD2.1
N$130: IC17.1(QB) PKD4.1
PBANK: DD1.12(F:O) DD7.9(CLK)
R: DD4.11 IC21.11(A) JP3.1 R43.2
R_INT: DD4.21 R25.1
RAS_RAM: C4.2 DD5.5(!RAS) DD6.5(!RAS) R23.1
RES: IC1.3(A:O) IC1.4(B:I0) IC1.5(B:I1) RES.1
SL: C8.- X1.1 X3.7
SOUND-IN: R29.2 R37.2
SR: C7.- X2.1 X3.6
SYNC: DD4.43 JP3.7 R46.2
TAPE_IN: DD4.19 TI.2
TAPE_OUT: DD4.13 TO.2
TO: TO.1
Y: DD4.18 IC21.1(D3) IC21.2(D2) IC21.3(D1) IC21.12(D7) IC21.13(D6) IC21.14(D5) IC21.15(D4)
Unconnected: CN1.3 CN1.4 CN1.5 CN1.6 CN1.7 CN1.8 CN1.9 CN1.10 CN1.11 CN1.12 CN1.13 CN1.14 CN1.15 CN1.16 CN1.17 CN1.18 CN1.19 CN1.20 CN1.21 CN1.22 CN1.23 CN1.24 CN1.25 CN1.26 CN1.27 CN1.28 CN1.29 CN1.30 CN1.31 CN1.32 CN1.33 CN1.34 CN1.35 CN1.36 CN1.37 CN1.38 CN1.39 CN1.40 CN1.41 CN1.42 CN1.43 CN1.44 CN1.45 CN1.46 DD1.1(A:I) DD1.2(A:O) DD1.3(B:I) DD1.4(B:O) DD1.5(C:I) DD1.6(C:O) DD1.8(D:O) DD1.9(D:I) DD2.18(HALT) DD7.3(!Q1) DD7.6(!Q2) DD7.11(!Q3) H1.B3,3(MOUNT) IC5.8(C:O) IC5.9(C:I0) IC5.10(C:I1) IC5.11(D:O) IC5.12(D:I0) IC5.13(D:I1) IC12.2(NC) IC12.5(NC2) IC12.6(IOB7) IC12.7(IOB6) IC12.8(IOB5) IC12.9(IOB4) IC12.10(IOB3) IC12.11(IOB2) IC12.12(IOB1) IC12.13(IOB0) IC12.14(IOA7) IC12.15(IOA6) IC12.16(IOA5) IC12.17(IOA4) IC12.18(IOA3) IC12.19(IOA2) IC12.20(IOA1) IC12.26(!SEL) IC12.39(TEST1) IC13.12(Y3) IC13.13(Y2) IC13.14(Y1) IC13.15(Y0) IC16.8(QC) IC16.9(QB) IC16.12(QA) IC17.4(QE) IC17.5(QF) IC17.9(QH*) IC18.9(QH*) IC19.8(QC) IC21.6(W) IC22.5 IC22.8 IC22.11 IC22.21 IC22.22 IC22.23 IC23.5(C:I) IC23.6(C:O) IC23.8(D:O) IC23.9(D:I) IC23.10(E:O) IC23.12(F:O) JP3.4 JP3.6 JP3.8 X3.8 X4.2 X4.3 X4.4 X4.5 X4.6 X4.7 X4.10 X4.11 X4.13 X4.14 X5.2 X5.3 X5.4 X5.5 X5.6 X5.7 X5.10 X5.11 X5.13 X5.14 X8.1 X8.2 X8.3 X8.4 X8.5 X8.6 X8.7 X8.8 X8.9 X8.10 X8.11 X8.12 X8.13 X8.14 X8.15 X8.16 X8.17 X8.18 X8.19 X8.20 X8.21

## Buses
A[0..15],AR[0..7],D[0..7],DB[0..7],DR[0..7],KD[0..6],KJ[0..7],B[0..3],!ROM,!MREQ,!IORQ,!BUSRQ,!BUSAK,PBANK,!ROMC,!SSRD,!INT,!NMI,!RES,RES,!M1,!SSRD,!RD,!SSWR,!WR,!RFSH,!RAS,!CAS,!WE,!WAIT,!CE,8M,CLK,CLC2,SYNC,BR,R,G,B,CA,CB,CC,BEEPER,SR,SL,1IC8,SOUND-IN,TO,TAPE_IN,TAPE_OUT

## Notes on the sheet
- нет пинов
  PBANK
  !ROMC
  SOUND-IN
- Right
- Left
- Down
- Up
- Start
- Select
- B
- A
- Right
- Left
- Down
- Up
- B
- A
- BR_fix
- R
- G
- B
- R | G | GND | B | SYNC | ~2V
- SYNC
- RAM
- КА1515ХМ1-216

## Power pins joined to a net without a drawn wire
GND: DD7.8(GND) DD8.7(P:GND) IC1.7(P:GND) IC2.10(P:GND) IC5.7(P:GND) IC6.10(GND) IC13.8(GND) IC14.7(P:GND) IC17.8(GND) IC18.8(GND) IC19.10(GND) IC20.7(P:GND) IC21.8(GND) IC23.7(P:GND)
VCC: DD7.16(VCC) DD8.14(P:VCC) IC1.14(P:VCC) IC2.20(P:VCC) IC5.14(P:VCC) IC6.20(VCC) IC13.16(VCC) IC14.14(P:VCC) IC17.16(VCC) IC18.16(VCC) IC19.5(VCC) IC20.14(P:VCC) IC21.16(VCC) IC23.14(P:VCC)

## Library data of the parts
/RES A0 A1-A15 AR0 AR1-AR7 B0 B1-B3 BUSAK BUSRQ CE DB0 DB1-DB7 DR0 DR1-DR7 INT IORQ KA8-KA15 KD0 KD1-KD4 M1 MREQ NMI PKD0 PKD1-PKD4 PKD6 RD RES RFSH ROM SSWR WAIT WR = pinhead:PINHD-1X1: PIN HEADER
C1 C4-C6 C23-C27 C29 C34 C36-C40 C42 = rcl:C-EU: CAPACITOR, European symbol; OC_FARNELL: unknown
C2 = rcl:CPOL-EU: POLARIZED CAPACITOR, European symbol; MF: MULTICOMP; MPN: MCNP35V106M5X11; OC_FARNELL: 1236669
C7 C8 C22 C28 C30-C33 C35 C41 C43 C47 = rcl:CPOL-EU: POLARIZED CAPACITOR, European symbol; OC_FARNELL: unknown
CN1 = alf_cartridge_slot:СНП15-48; OC_FARNELL: unknown
D1-D3 = adafruit:DIODE: Diode SMADIODE - SMA Surface Mount Package 20V 1A Schottky Diode Digikey: 641-1014-6-ND DO-1N4148 - Through Hole Small Current Diode SOD-123 20V 1 A (.5mV Vf) Schottky Diode - Digikey: MBRX120TPMSCT-ND SOD-323 10V 570mA (.38mV Vf, 3ns) Schottky Diode - Digikey: ZLLS410CT-ND SOD-523 30V 30mA Schottky Diode (RB751S-40TE61) - Digikey: RB751S-40TE61CT-ND SOT23-R/W - SOT23 Package (R = Solder Paste/Reflow Ovens, W = Hand-Soldering) BAT54Film 40V 300mA - Digikey: 497-7162-1-ND; OC_FARNELL: unknown
D4-D12 = diode:DIODE-: DIODE
DD1 IC20 = 74xx-eu:74*04: Hex INVERTER; OC_FARNELL: unknown
DD2 = zilog:Z80CPU: Z80 FAMILY DEVICE
DD3 = AT27C020:AT27C020-90PU: ONE TIME PROGRAMMABLE (OTP) EPROM IC,2Mb (256K x 8),PDIP-32; MF: ATMEL; MPN: AT27C020-90PU; OC_FARNELL: 1095777; OC_NEWARK: 68T4266; PACKAGE: PDIP-32; SUPPLIER: ATMEL
DD4 = Т43ВГ1:Т34ВГ1
DD5 DD6 = memories:41464: DRAM 64K x 4 bits
DD7 = 74xx-eu:74*175: Qadruple D type FLIP FLOP, clear; OC_FARNELL: unknown
DD8 = 74xx-eu:74*32: Quad 2-input OR gate; OC_FARNELL: unknown
H1 = holes:MOUNT-PAD-ROUND: MOUNTING PAD, round
IC1 = 74xx-eu:74*00: Quad 2-input NAND gate
IC2 = 74xx-eu:74*240: Octal BUFFER and LINE DRIVER, 3-state; OC_FARNELL: unknown
IC5 = 74xx-eu:74*09: Quad 2-input AND gate, open collector; OC_FARNELL: unknown
IC6 = 74xx-eu:74*245: Octal BUS TRANSCEIVER, 3-state; OC_FARNELL: unknown
IC12 = ym2149f:YM2149F; OC_FARNELL: unknown
IC13 = 74xx-eu:74*138: 3-line to 8-line DECODER/DEMULTIPLEXER; OC_FARNELL: unknown
IC14 = 74xx-eu:74*00: Quad 2-input NAND gate; OC_FARNELL: unknown
IC16 IC19 = 74xx-eu:74*93: Decade, divide by twelve and binary COUNTER; OC_FARNELL: unknown
IC17 IC18 = 74xx-eu:74*595: 8-bit SHIFT REGISTER, output latch; OC_FARNELL: unknown
IC21 = 74xx-eu:74*251: 1 of 8 data SELECTOR/MULTIPLEXER, 3-state; OC_FARNELL: unknown
IC22 = CXA1645M:CXA1645; OC_FARNELL: unknown
IC23 = 74xx-eu:74*04: Hex INVERTER
J1 = adafruit:2.1MMJACK: 2.1mm x 5.5mm THM DC jack with internal switch. Digikey part #PJ-102A, 4UCON part #05537 2.1mm x 5.5mm SMT DC jack with internal switch. Digikey part #PJ-002A-SMT, 4UCON part #03267 By microbuilder.eu & adafruit.com
JB0 JB1-JB4 ROMCE = jumper:SJ: SMD solder JUMPER
JP1A JP1A1 = pinhead:PINHD-1X3: PIN HEADER; OC_FARNELL: unknown
JP1B JPORT = jumper:SJ2W: SMD solder JUMPER
JP3 = pinhead:PINHD-2X5: PIN HEADER; OC_FARNELL: unknown
JP4 TI TO = pinhead:PINHD-1X2: PIN HEADER
L1 = inductor-neosid:Z?CW: CHOKE free-suspension choke/nominal inductance winding clockwise; OC_FARNELL: unknown; OC_NEWARK: unknown
Q1-Q3 = crystal:CRYSTAL: CRYSTAL; MF: MULTICOMP; MPN: HC49SM-3.6864-30-50-60-16-ATF; OC_FARNELL: 1667008; OC_NEWARK: unknown
R1-R58 R64-R71 = rcl:R-EU_: RESISTOR, European symbol; OC_FARNELL: unknown
R60-R63 = pot:TRIM_EU-: POTENTIOMETER; OC_FARNELL: unknown
S1 = switch-omron:10-XX: OMRON SWITCH; MF: OMRON ELECTRONIC COMPONENTS; MPN: B3F-1000; OC_FARNELL: 176432; OC_NEWARK: 36M3542
T1-T4 = transistor:*-NPN-: NPN Transistror BF959 corrected 2008.03.06; OC_FARNELL: unknown
X1 X2 X6 = con-hirschmann:TOBU3: Female Cinch CONNECTOR ( RCA Jack ); MF: HIRSCHMANN; MPN: TOBU 3; OC_FARNELL: 592791; OC_NEWARK: 06WX5914
X3 = con-thomas-betts:D-SUB9-: D-Subminiatur Connector Source: Electronioc Interconnects European Edition 1998; OC_FARNELL: unknown; OC_NEWARK: unknown
X4 X5 = con-subd:M15: SUB-D; OC_FARNELL: unknown; OC_NEWARK: unknown
X7 = mini_din:MINI_DIN_4
X8 = con-hirschmann:SCART-F: TV SCART CONNECTOR; OC_FARNELL: unknown; OC_NEWARK: unknown